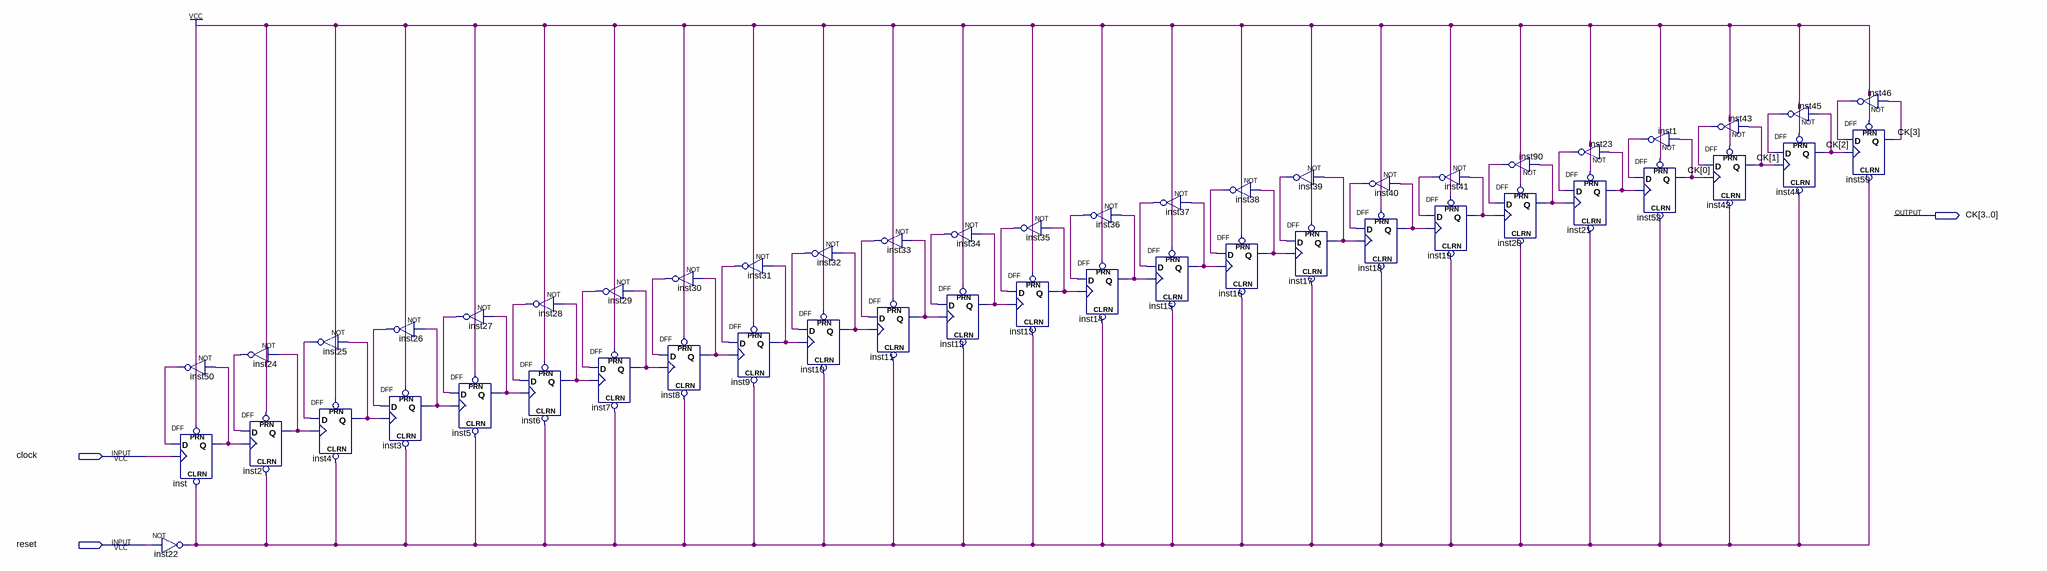
[diagram p0: schematic sheet]
// Quartus schematic FREQ_DIV.bdf as structural Verilog: 51 symbols, 3 pins
module FREQ_DIV (
  input  clock,
  input  reset,
  output [3:0] CK
);

  wire inst1_out, inst2_q, inst3_q, inst4_q, inst5_q, inst6_q, inst7_q, inst8_q, inst9_q, inst10_q, inst11_q,
       inst12_q, inst13_q, inst14_q, inst15_q, inst16_q, inst17_q, inst18_q, inst19_q, inst20_q, inst21_q,
       inst22_out, inst23_out, inst24_out, inst25_out, inst26_out, inst27_out, inst28_out, inst29_out,
       inst30_out, inst31_out, inst32_out, inst33_out, inst34_out, inst35_out, inst36_out, inst37_out,
       inst38_out, inst39_out, inst40_out, inst41_out, inst43_out, inst45_out, inst46_out, inst50_out,
       inst90_out, inst_q;

  not inst50 (inst50_out, inst_q);
  DFF inst (.CLRN(inst22_out), .CLK(clock), .D(inst50_out), .PRN(1'b1), .Q(inst_q));
  not inst22 (inst22_out, reset);
  not inst24 (inst24_out, inst2_q);
  DFF inst2 (.CLRN(inst22_out), .CLK(inst_q), .D(inst24_out), .PRN(1'b1), .Q(inst2_q));
  not inst25 (inst25_out, inst4_q);
  DFF inst4 (.CLRN(inst22_out), .CLK(inst2_q), .D(inst25_out), .PRN(1'b1), .Q(inst4_q));
  not inst26 (inst26_out, inst3_q);
  DFF inst3 (.CLRN(inst22_out), .CLK(inst4_q), .D(inst26_out), .PRN(1'b1), .Q(inst3_q));
  not inst27 (inst27_out, inst5_q);
  DFF inst5 (.CLRN(inst22_out), .CLK(inst3_q), .D(inst27_out), .PRN(1'b1), .Q(inst5_q));
  not inst28 (inst28_out, inst6_q);
  DFF inst6 (.CLRN(inst22_out), .CLK(inst5_q), .D(inst28_out), .PRN(1'b1), .Q(inst6_q));
  not inst29 (inst29_out, inst7_q);
  DFF inst7 (.CLRN(inst22_out), .CLK(inst6_q), .D(inst29_out), .PRN(1'b1), .Q(inst7_q));
  not inst30 (inst30_out, inst8_q);
  DFF inst8 (.CLRN(inst22_out), .CLK(inst7_q), .D(inst30_out), .PRN(1'b1), .Q(inst8_q));
  not inst31 (inst31_out, inst9_q);
  DFF inst9 (.CLRN(inst22_out), .CLK(inst8_q), .D(inst31_out), .PRN(1'b1), .Q(inst9_q));
  DFF inst10 (.CLRN(inst22_out), .CLK(inst9_q), .D(inst32_out), .PRN(1'b1), .Q(inst10_q));
  not inst32 (inst32_out, inst10_q);
  not inst33 (inst33_out, inst11_q);
  DFF inst11 (.CLRN(inst22_out), .CLK(inst10_q), .D(inst33_out), .PRN(1'b1), .Q(inst11_q));
  not inst34 (inst34_out, inst12_q);
  DFF inst12 (.CLRN(inst22_out), .CLK(inst11_q), .D(inst34_out), .PRN(1'b1), .Q(inst12_q));
  not inst35 (inst35_out, inst13_q);
  DFF inst13 (.CLRN(inst22_out), .CLK(inst12_q), .D(inst35_out), .PRN(1'b1), .Q(inst13_q));
  not inst36 (inst36_out, inst14_q);
  DFF inst14 (.CLRN(inst22_out), .CLK(inst13_q), .D(inst36_out), .PRN(1'b1), .Q(inst14_q));
  not inst37 (inst37_out, inst15_q);
  DFF inst15 (.CLRN(inst22_out), .CLK(inst14_q), .D(inst37_out), .PRN(1'b1), .Q(inst15_q));
  not inst38 (inst38_out, inst16_q);
  DFF inst16 (.CLRN(inst22_out), .CLK(inst15_q), .D(inst38_out), .PRN(1'b1), .Q(inst16_q));
  not inst39 (inst39_out, inst17_q);
  DFF inst17 (.CLRN(inst22_out), .CLK(inst16_q), .D(inst39_out), .PRN(1'b1), .Q(inst17_q));
  DFF inst18 (.CLRN(inst22_out), .CLK(inst17_q), .D(inst40_out), .PRN(1'b1), .Q(inst18_q));
  not inst40 (inst40_out, inst18_q);
  not inst41 (inst41_out, inst19_q);
  DFF inst19 (.CLRN(inst22_out), .CLK(inst18_q), .D(inst41_out), .PRN(1'b1), .Q(inst19_q));
  not inst90 (inst90_out, inst20_q);
  DFF inst20 (.CLRN(inst22_out), .CLK(inst19_q), .D(inst90_out), .PRN(1'b1), .Q(inst20_q));
  not inst23 (inst23_out, inst21_q);
  DFF inst21 (.CLRN(inst22_out), .CLK(inst20_q), .D(inst23_out), .PRN(1'b1), .Q(inst21_q));
  not inst1 (inst1_out, CK[0]);
  DFF inst52 (.CLRN(inst22_out), .CLK(inst21_q), .D(inst1_out), .PRN(1'b1), .Q(CK[0]));
  not inst43 (inst43_out, CK[1]);
  DFF inst42 (.CLRN(inst22_out), .CLK(CK[0]), .D(inst43_out), .PRN(1'b1), .Q(CK[1]));
  not inst45 (inst45_out, CK[2]);
  DFF inst44 (.CLRN(inst22_out), .CLK(CK[1]), .D(inst45_out), .PRN(1'b1), .Q(CK[2]));
  not inst46 (inst46_out, CK[3]);
  DFF inst59 (.CLRN(inst22_out), .CLK(CK[2]), .D(inst46_out), .PRN(1'b1), .Q(CK[3]));
endmodule
